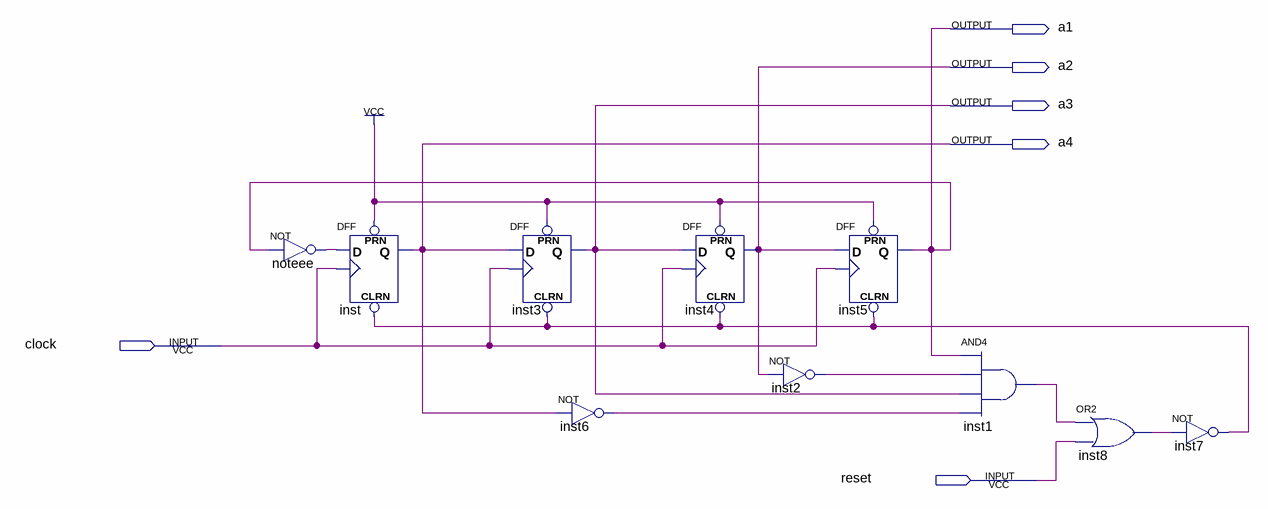
[diagram p0: schematic sheet]
// Quartus schematic syncCounter.bdf as structural Verilog: 10 symbols, 6 pins
module syncCounter (
  input  clock,
  input  reset,
  output a1,
  output a2,
  output a3,
  output a4
);

  wire inst1_out, inst2_out, inst6_out, inst7_out, inst8_out, noteee_out;

  not noteee (noteee_out, a1);
  DFF inst (.CLRN(inst7_out), .CLK(clock), .D(noteee_out), .PRN(1'b1), .Q(a4));
  DFF inst3 (.CLRN(inst7_out), .CLK(clock), .D(a4), .PRN(1'b1), .Q(a3));
  not inst6 (inst6_out, a4);
  DFF inst4 (.CLRN(inst7_out), .CLK(clock), .D(a3), .PRN(1'b1), .Q(a2));
  not inst2 (inst2_out, a2);
  DFF inst5 (.CLRN(inst7_out), .CLK(clock), .D(a2), .PRN(1'b1), .Q(a1));
  and inst1 (inst1_out, a1, inst2_out, a3, inst6_out);
  or inst8 (inst8_out, inst1_out, reset);
  not inst7 (inst7_out, inst8_out);
endmodule
